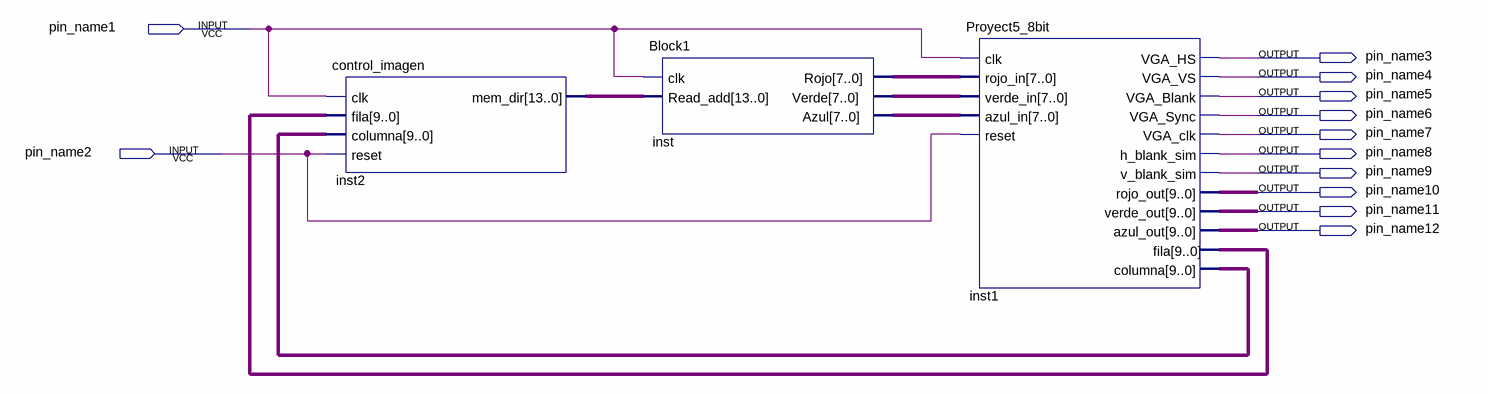
[diagram p0: schematic sheet]
// Quartus schematic d.bdf as structural Verilog: 3 symbols, 12 pins
module d (
  input  pin_name1,
  input  pin_name2,
  output pin_name3,
  output pin_name4,
  output pin_name5,
  output pin_name6,
  output pin_name7,
  output pin_name8,
  output pin_name9,
  output pin_name10,
  output pin_name11,
  output pin_name12
);

  wire [7:0] inst_azul, inst_rojo, inst_verde;
  wire [9:0] inst1_azul_out, inst1_columna, inst1_fila, inst1_rojo_out, inst1_verde_out;
  wire [13:0] inst2_mem_dir;

  control_imagen inst2 (
    .clk(pin_name1), .fila(inst1_fila), .columna(inst1_columna), .reset(pin_name2), .mem_dir(inst2_mem_dir));
  Block1 inst (.clk(pin_name1), .Read_add(inst2_mem_dir), .Rojo(inst_rojo), .Verde(inst_verde), .Azul(inst_azul));
  Proyect5_8bit inst1 (
    .clk(pin_name1), .rojo_in(inst_rojo), .verde_in(inst_verde), .azul_in(inst_azul), .reset(pin_name2),
    .VGA_HS(pin_name3), .VGA_VS(pin_name4), .VGA_Blank(pin_name5), .VGA_Sync(pin_name6), .VGA_clk(pin_name7),
    .h_blank_sim(pin_name8), .v_blank_sim(pin_name9), .rojo_out(inst1_rojo_out), .verde_out(inst1_verde_out),
    .azul_out(inst1_azul_out), .fila(inst1_fila), .columna(inst1_columna));
endmodule
